# Altium project RTDMeasurement.PrjPcb (part 1 of 2)
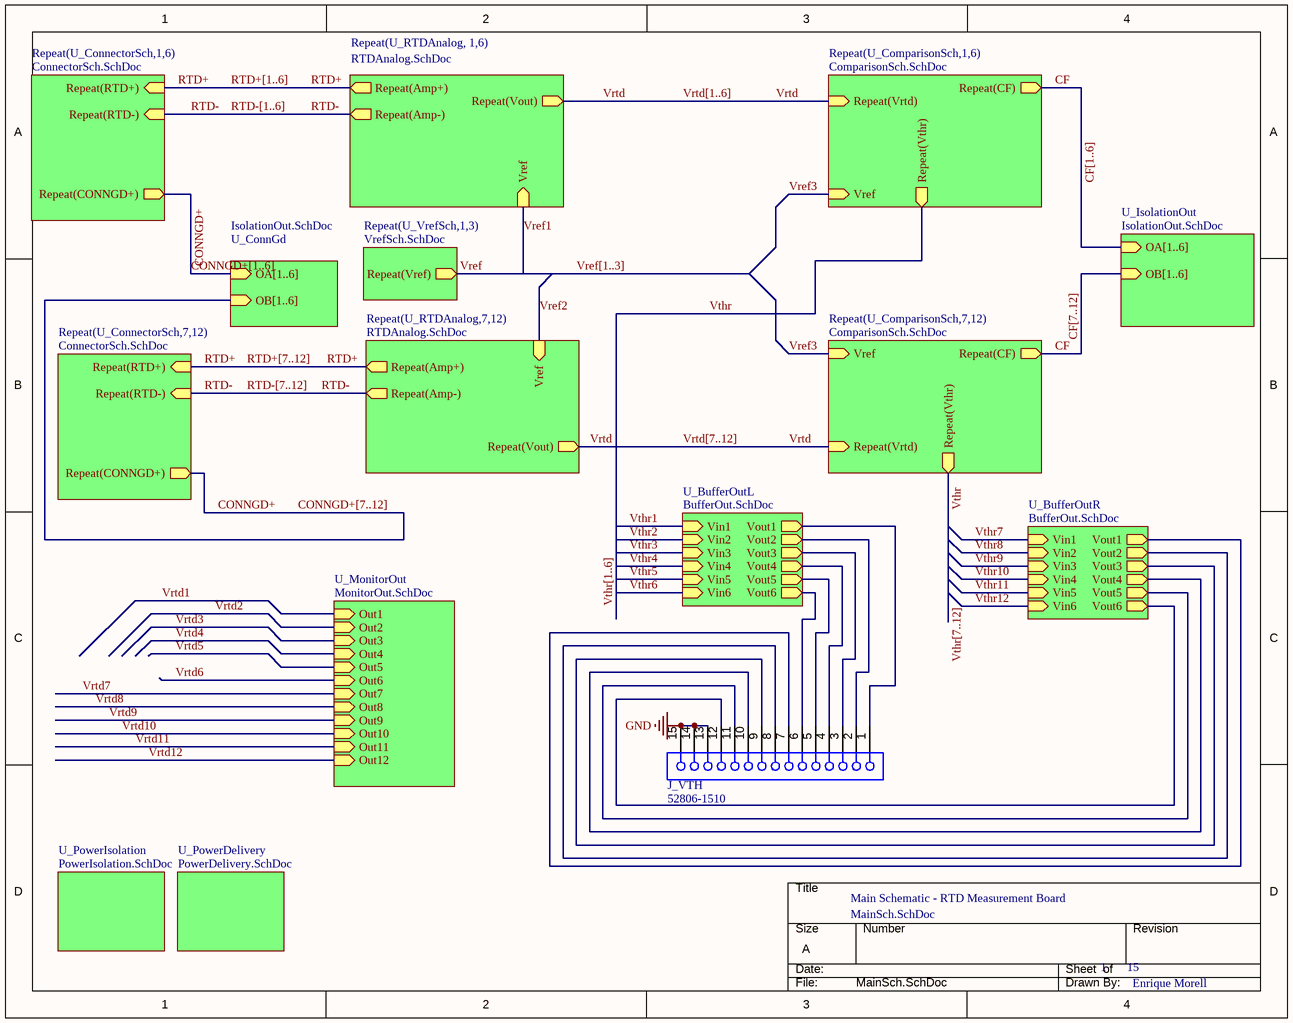
[diagram p0: MainSch.SchDoc]
14 sheets, 306 parts. Net scope: hierarchical (ports join the sheet entries above them; power ports are global).
Board files: RTD_12POS_WPS.PcbDoc, OneChannelPrototype.PcbDoc, RTD_12POS_WPSv2.PcbDoc, RTD_12POS_WPSv3.PcbDoc, RTD_12POS_WPSv4.PcbDoc
Sheets:
  MainSch.SchDoc
    U_RTDAnalog1 = RTDAnalog.SchDoc
    U_RTDAnalog2 = RTDAnalog.SchDoc
    U_RTDAnalog3 = RTDAnalog.SchDoc
    U_RTDAnalog4 = RTDAnalog.SchDoc
    U_RTDAnalog5 = RTDAnalog.SchDoc
    U_RTDAnalog6 = RTDAnalog.SchDoc
    U_VrefSch1 = VrefSch.SchDoc
    U_VrefSch2 = VrefSch.SchDoc
    U_VrefSch3 = VrefSch.SchDoc
    U_RTDAnalog7 = RTDAnalog.SchDoc
    U_RTDAnalog8 = RTDAnalog.SchDoc
    U_RTDAnalog9 = RTDAnalog.SchDoc
    U_RTDAnalog10 = RTDAnalog.SchDoc
    U_RTDAnalog11 = RTDAnalog.SchDoc
    U_RTDAnalog12 = RTDAnalog.SchDoc
    U_ConnectorSch1 = ConnectorSch.SchDoc
    U_ConnectorSch2 = ConnectorSch.SchDoc
    U_ConnectorSch3 = ConnectorSch.SchDoc
    U_ConnectorSch4 = ConnectorSch.SchDoc
    U_ConnectorSch5 = ConnectorSch.SchDoc
    U_ConnectorSch6 = ConnectorSch.SchDoc
    U_ComparisonSch1 = ComparisonSch.SchDoc
    U_ComparisonSch2 = ComparisonSch.SchDoc
    U_ComparisonSch3 = ComparisonSch.SchDoc
    U_ComparisonSch4 = ComparisonSch.SchDoc
    U_ComparisonSch5 = ComparisonSch.SchDoc
    U_ComparisonSch6 = ComparisonSch.SchDoc
    U_ComparisonSch7 = ComparisonSch.SchDoc
    U_ComparisonSch8 = ComparisonSch.SchDoc
    U_ComparisonSch9 = ComparisonSch.SchDoc
    U_ComparisonSch10 = ComparisonSch.SchDoc
    U_ComparisonSch11 = ComparisonSch.SchDoc
    U_ComparisonSch12 = ComparisonSch.SchDoc
    U_IsolationOut = IsolationOut.SchDoc
    U_PowerDelivery = PowerDelivery.SchDoc
      U_VccConnSch = VccConnSch.SchDoc
      U_Neg12V = Neg12V.SchDoc
      U_12VSupply = 12VSupply.SchDoc
      U_5VSupply = 5VSupply.SchDoc
    U_PowerIsolation = PowerIsolation.SchDoc
    U_MonitorOut = MonitorOut.SchDoc
      U_BufferOutMonL = BufferOut.SchDoc
      U_BufferOutMonR = BufferOut.SchDoc
    U_ConnectorSch7 = ConnectorSch.SchDoc
    U_ConnectorSch8 = ConnectorSch.SchDoc
    U_ConnectorSch9 = ConnectorSch.SchDoc
    U_ConnectorSch10 = ConnectorSch.SchDoc
    U_ConnectorSch11 = ConnectorSch.SchDoc
    U_ConnectorSch12 = ConnectorSch.SchDoc
    U_ConnGd = IsolationOut.SchDoc
    U_BufferOutR = BufferOut.SchDoc
    U_BufferOutL = BufferOut.SchDoc

## Sheet MainSch.SchDoc: Main Schematic - RTD Measurement Board
size A; Author: Enrique Morell; SheetNumber: 1; SheetTotal: 15

### Parts
J_VTH  52806-1510  [MOLX-52806-1510]

### Sub-sheets
Repeat(U_ComparisonSch,1,6) = ComparisonSch.SchDoc: Vref (in), Repeat(Vrtd) (in), Repeat(CF) (out), Repeat(Vthr) (out)
Repeat(U_ComparisonSch,7,12) = ComparisonSch.SchDoc: Vref (in), Repeat(Vrtd) (in), Repeat(CF) (out), Repeat(Vthr) (out)
Repeat(U_ConnectorSch,1,6) = ConnectorSch.SchDoc: Repeat(RTD+) (in), Repeat(RTD-) (in), Repeat(CONNGD+) (out)
Repeat(U_ConnectorSch,7,12) = ConnectorSch.SchDoc: Repeat(RTD+) (in), Repeat(RTD-) (in), Repeat(CONNGD+) (out)
Repeat(U_RTDAnalog,7,12) = RTDAnalog.SchDoc: Repeat(Amp+) (out), Vref (in), Repeat(Vout) (out), Repeat(Amp-) (out)
Repeat(U_RTDAnalog, 1,6) = RTDAnalog.SchDoc: Vref (in), Repeat(Amp+) (out), Repeat(Vout) (out), Repeat(Amp-) (out)
Repeat(U_VrefSch,1,3) = VrefSch.SchDoc: Repeat(Vref) (out)
U_BufferOutL = BufferOut.SchDoc: Vin1 (in), Vout1 (out), Vin2 (in), Vout2 (out), Vin3 (in), Vout3 (out), Vin4 (in), Vout4 (out), Vin5 (in), Vout5 (out), Vin6 (in), Vout6 (out)
U_BufferOutR = BufferOut.SchDoc: Vin1 (in), Vout1 (out), Vin2 (in), Vout2 (out), Vin3 (in), Vout3 (out), Vin4 (in), Vout4 (out), Vin5 (in), Vout5 (out), Vin6 (in), Vout6 (out)
U_ConnGd = IsolationOut.SchDoc: OA[1..6] (in), OB[1..6] (in)
U_IsolationOut = IsolationOut.SchDoc: OA[1..6] (in), OB[1..6] (in)
U_MonitorOut = MonitorOut.SchDoc: Out1 (in), Out2 (in), Out3 (in), Out4 (in), Out5 (in), Out6 (in), Out7 (in), Out9 (in), Out10 (in), Out11 (in), Out12 (in), Out8 (in)
U_PowerDelivery = PowerDelivery.SchDoc: no entries
U_PowerIsolation = PowerIsolation.SchDoc: no entries

### Nets
GND: J_VTH.13 J_VTH.14 J_VTH.15
CF: sheet Repeat(U_ComparisonSch,1,6)/Repeat(CF), sheet Repeat(U_ComparisonSch,7,12)/Repeat(CF)
CONNGD+: sheet Repeat(U_ConnectorSch,1,6)/Repeat(CONNGD+), sheet Repeat(U_ConnectorSch,7,12)/Repeat(CONNGD+)
RTD+: sheet Repeat(U_RTDAnalog, 1,6)/Repeat(Amp+), sheet Repeat(U_RTDAnalog,7,12)/Repeat(Amp+), sheet Repeat(U_ConnectorSch,1,6)/Repeat(RTD+), sheet Repeat(U_ConnectorSch,7,12)/Repeat(RTD+)
RTD-: sheet Repeat(U_RTDAnalog, 1,6)/Repeat(Amp-), sheet Repeat(U_RTDAnalog,7,12)/Repeat(Amp-), sheet Repeat(U_ConnectorSch,1,6)/Repeat(RTD-), sheet Repeat(U_ConnectorSch,7,12)/Repeat(RTD-)
Vref: sheet Repeat(U_VrefSch,1,3)/Repeat(Vref)
Vref3: sheet Repeat(U_ComparisonSch,1,6)/Vref, sheet Repeat(U_ComparisonSch,7,12)/Vref
Vrtd: sheet Repeat(U_RTDAnalog, 1,6)/Repeat(Vout), sheet Repeat(U_RTDAnalog,7,12)/Repeat(Vout), sheet Repeat(U_ComparisonSch,1,6)/Repeat(Vrtd), sheet Repeat(U_ComparisonSch,7,12)/Repeat(Vrtd)
Vthr: sheet Repeat(U_ComparisonSch,1,6)/Repeat(Vthr), sheet Repeat(U_ComparisonSch,7,12)/Repeat(Vthr)
NetJ_VTH_1: J_VTH.1 ; sheet U_BufferOutL/Vout1
NetJ_VTH_2: J_VTH.2 ; sheet U_BufferOutL/Vout2
NetJ_VTH_3: J_VTH.3 ; sheet U_BufferOutL/Vout3
NetJ_VTH_4: J_VTH.4 ; sheet U_BufferOutL/Vout4
NetJ_VTH_5: J_VTH.5 ; sheet U_BufferOutL/Vout5
NetJ_VTH_6: J_VTH.6 ; sheet U_BufferOutL/Vout6
NetJ_VTH_7: J_VTH.7 ; sheet U_BufferOutR/Vout1
NetJ_VTH_8: J_VTH.8 ; sheet U_BufferOutR/Vout2
NetJ_VTH_9: J_VTH.9 ; sheet U_BufferOutR/Vout3
NetJ_VTH_10: J_VTH.10 ; sheet U_BufferOutR/Vout4
NetJ_VTH_11: J_VTH.11 ; sheet U_BufferOutR/Vout5
NetJ_VTH_12: J_VTH.12 ; sheet U_BufferOutR/Vout6

### Buses and harness runs
bus CF[1..6] = sheet U_IsolationOut/OA[1..6]
bus CF[7..12] = sheet U_IsolationOut/OB[1..6]
bus CONNGD+[1..6] = sheet U_ConnGd/OA[1..6]
bus CONNGD+[7..12] = sheet U_ConnGd/OB[1..6]
bus RTD+[1..6]
bus RTD+[7..12]
bus RTD-[1..6]
bus RTD-[7..12]
bus Vref[1..3]
bus Vrtd[1..6]
bus Vrtd[7..12]
bus Vthr[1..6]
bus Vthr[7..12]

### Notes on the sheet
- THIS DOCUMENT AND THE DATA DISCLOSED HEREIN OR
- HEREWITH IS THE PROPERTY OF ALTIUM LIMITED AND MAY
- DWG NO:
- REVISION
- REV:
- DESCRIPTION
- DATE
- APPROVED
- BE FREELY DISTRIBUTED IN WHOLE. NO RIGHTS ARE
- RESERVED OR EXPRESS OR IMPLIED WARANTEE GIVEN.
- ENG:
- APPROVALS
- PROJECT
- DSN:
- CHK:
- REFERENCE DOCUMENTS
- PROJECT REVISION:
- TITLE
- DOCUMENT REVISION:
- DESIGN ITEM:
- BOM:
- FAB DWG:
- PCB DWG:
- ASSY DWG:
- SCALE:
- A3
- SIZE
- CAGE CODE
- FILE NAME
- DWG NO.
- SHEET
- OF
- REV

### Library data of the parts
J_VTH = CMP-1242-00172-1: 1.0 mm Pitch FFC Connector, 5.4 mm Mated Height, Vertical, Non-ZIF, Through Hole, 15 Circuits, -20 to 80 degC, ELV and RoHS Compliant, Tray; Manufacturer: Molex; Voltage (Max): 50V AC (RMS)/DC; Pitch - Mating Interface: 1.00mm; Circuits (maximum): 15; Durability (mating cycles max): 10; Stackable: No; Current (Max per Contact): 0.5A; Mated Height: 5.40mm; Material - Plating Mating: Tin; PCB Retention: None; Material - Metal: Phosphor Bronze; ComponentLink3URL: http://www.molex.com/pdm_docs/sd/528061510_sd.pdf; PartNumber: 52806-1510; ComponentLink2URL: http://www.molex.com/webdocs/datasheets/pdf/en-us/0528061510_FFC_FPC_CONNECTORS.pdf; PackageVersion: Rev. B, 08/2002; Pitch - Termination Interface: 1.00mm; Circuits (Loaded): 15; PackageDescription: 15-Lead FFC Connector, Pitch 1.0 mm; ComponentLink1URL: http://www.molex.com/molex/index.jsp; Packing: Tray; ComponentLink1Description: Manufacturer URL; Entry Angle: Vertical; Contact Position: N/A; PCB Locator: No; Number of Rows: 1; ComponentLink2Description: Datasheet; Material - Plating Termination: Tin; Orientation: Vertical; RoHS: TRUE; PackageReference: 52806-1510; ComponentLink3Description: Package Specification; Mounting Technology: Through Hole; Polarized to PCB: No

## Sheet RTDAnalog.SchDoc
size A
Used 12 times, as channels U_RTDAnalog1, U_RTDAnalog2, U_RTDAnalog3, U_RTDAnalog4, U_RTDAnalog5, U_RTDAnalog6, U_RTDAnalog7, U_RTDAnalog8, U_RTDAnalog9, U_RTDAnalog10, U_RTDAnalog11, U_RTDAnalog12. Parts and nets are listed once, with the designators drawn on the sheet.
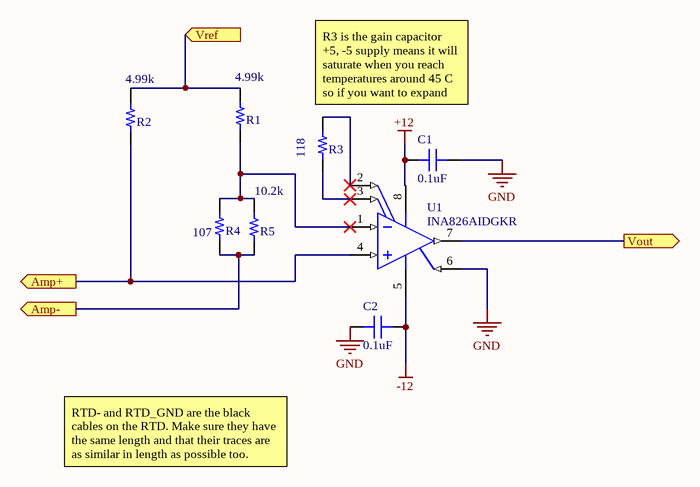
[diagram p1: RTDAnalog.SchDoc]

### Parts
C1  0.1uF  [CAP 0805/2012]
C2  0.1uF  [CAP 0805/2012]
R1  4.99k  [RES 0805/2012]
R2  4.99k  [RES 0805/2012]
R3  118  [RES 0805/2012]
R4  107  [RES 0805/2012]
R5  10.2k  [RES 0805/2012]
U1  INA826AIDGKR  [DGK0008A_N]

### Ports
Amp+ (out), Amp- (out), Vout (out), Vref (in)

### Nets
+12: C1.1 U1.8(VS+)
-12: C2.2 U1.5(VS-)
GND: C1.2 C2.1 U1.6(REF)
Amp+: R2.1 U1.4(IN+) ; port Amp+
Amp-: R4.1 R5.1 ; port Amp-
Vout: U1.7(VOUT) ; port Vout
Vref: R1.2 R2.2 ; port Vref
NetR1_1: R1.1 R4.2 R5.2 U1.1(IN-)
NetR3_1: R3.1 U1.3(RG)
NetR3_2: R3.2 U1.2(RG)

### Channels
U_RTDAnalog1: designators end in A; ports Amp+=RTD+1 Amp-=RTD-1 Vout=Vrtd1 Vref=Vref1
U_RTDAnalog2: designators end in B; ports Amp+=RTD+2 Amp-=RTD-2 Vout=Vrtd2 Vref=Vref1
U_RTDAnalog3: designators end in C; ports Amp+=RTD+3 Amp-=RTD-3 Vout=Vrtd3 Vref=Vref1
U_RTDAnalog4: designators end in D; ports Amp+=RTD+4 Amp-=RTD-4 Vout=Vrtd4 Vref=Vref1
U_RTDAnalog5: designators end in E; ports Amp+=RTD+5 Amp-=RTD-5 Vout=Vrtd5 Vref=Vref1
U_RTDAnalog6: designators end in F; ports Amp+=RTD+6 Amp-=RTD-6 Vout=Vrtd6 Vref=Vref1
U_RTDAnalog7: designators end in G; ports Amp+=RTD+7 Amp-=RTD-7 Vout=Vrtd7 Vref=Vref2
U_RTDAnalog8: designators end in H; ports Amp+=RTD+8 Amp-=RTD-8 Vout=Vrtd8 Vref=Vref2
U_RTDAnalog9: designators end in I; ports Amp+=RTD+9 Amp-=RTD-9 Vout=Vrtd9 Vref=Vref2
U_RTDAnalog10: designators end in J; ports Amp+=RTD+10 Amp-=RTD-10 Vout=Vrtd10 Vref=Vref2
U_RTDAnalog11: designators end in K; ports Amp+=RTD+11 Amp-=RTD-11 Vout=Vrtd11 Vref=Vref2
U_RTDAnalog12: designators end in L; ports Amp+=RTD+12 Amp-=RTD-12 Vout=Vrtd12 Vref=Vref2

### Notes on the sheet
- (near R3) R3 is the gain capacitor
  +5, -5 supply means it will saturate when you reach temperatures around 45 C so if you want to expand the range change the supply to +12, -12V. We use +5, -5 to simplify the power supply requirements considerably.
- RTD- and RTD_GND are the black cables on the RTD. Make sure they have the same length and that their traces are as similar in length as possible too.

### Library data of the parts
C1 C2 = CL21B104KACNNNC: CAP CER 0.1UF 25V X7R 0805; Manufacturer: Samsung Electro-Mechanics America, Inc.; TemperatureRange: -55C ~ 125C; Tolerance: 10%; Value: 0.1uF; Part Number: CL21B104KACNNNC; PartId: 5699; Supplier 1: Digi-Key; Supplier Part Number 1: 1276-1099-2-ND; ComponentLink1Description: Datasheet; ComponentLink1URL: http://www.samsungsem.com/kr/support/product-search/mlcc/CL21B104KACNNNC.jsp; ComponentLink2Description: Digi-Key listing; ComponentLink2URL: http://digikey.com/product-detail/en/CL21B104KACNNNC/1276-1099-2-ND/3886757; TemperatureCoefficient: X7R; Voltage: 25V; Price: 0.0099; Device Package: 0805 (2012 Metric); Type: -
R1 R2 = ERA-6AEB4991V: RES SMD 4.99K OHM 0.1% 1/8W 0805; Manufacturer: Panasonic Electronic Components; TemperatureRange: -55C ~ 155C; TemperatureCoefficient: 25ppm/C; PowerRating: 0.125W, 1/8W; Value: 4.99k; Part Number: ERA-6AEB4991V; PartId: 2457; Supplier 1: Digi-Key; Supplier Part Number 1: P4.99KDATR-ND; ComponentLink1Description: Datasheet; ComponentLink1URL: http://industrial.panasonic.com/lecs/www-data/pdf/AOA0000/AOA0000CE26.pdf; ComponentLink2Description: Digi-Key listing; ComponentLink2URL: http://digikey.com/product-detail/en/ERA-6AEB4991V/P4.99KDATR-ND/2025726; Tolerance: 0.1%; Price: 0.0653; Type: Thin Film; Device Package: 0805 (2012 Metric)
R3 = ERA-6AEB1180V: RES SMD 118 OHM 0.1% 1/8W 0805; Manufacturer: Panasonic Electronic Components; TemperatureRange: -55C ~ 155C; TemperatureCoefficient: 25ppm/C; PowerRating: 0.125W, 1/8W; Value: 118; Part Number: ERA-6AEB1180V; PartId: 2788; Supplier 1: Digi-Key; Supplier Part Number 1: P118DATR-ND; ComponentLink1Description: Datasheet; ComponentLink1URL: http://industrial.panasonic.com/lecs/www-data/pdf/AOA0000/AOA0000CE26.pdf; ComponentLink2Description: Digi-Key listing; ComponentLink2URL: http://digikey.com/product-detail/en/ERA-6AEB1180V/P118DATR-ND/2025579; Tolerance: 0.1%; Price: 0.0653; Type: Thin Film; Device Package: 0805 (2012 Metric)
R4 = ERA-6AEB1070V: RES SMD 107 OHM 0.1% 1/8W 0805; Manufacturer: Panasonic Electronic Components; TemperatureRange: -55C ~ 155C; TemperatureCoefficient: 25ppm/C; PowerRating: 0.125W, 1/8W; Value: 107; Part Number: ERA-6AEB1070V; PartId: 2810; Supplier 1: Digi-Key; Supplier Part Number 1: P107DATR-ND; ComponentLink1Description: Datasheet; ComponentLink1URL: http://industrial.panasonic.com/lecs/www-data/pdf/AOA0000/AOA0000CE26.pdf; ComponentLink2Description: Digi-Key listing; ComponentLink2URL: http://digikey.com/product-detail/en/ERA-6AEB1070V/P107DATR-ND/2025576; Tolerance: 0.1%; Price: 0.0653; Type: Thin Film; Device Package: 0805 (2012 Metric)
R5 = ERA-6AEB1022V: RES SMD 10.2K OHM 0.1% 1/8W 0805; Manufacturer: Panasonic Electronic Components; TemperatureRange: -55C ~ 155C; TemperatureCoefficient: 25ppm/C; PowerRating: 0.125W, 1/8W; Value: 10.2k; Part Number: ERA-6AEB1022V; PartId: 2668; Supplier 1: Digi-Key; Supplier Part Number 1: P10.2KDATR-ND; ComponentLink1Description: Datasheet; ComponentLink1URL: http://industrial.panasonic.com/lecs/www-data/pdf/AOA0000/AOA0000CE26.pdf; ComponentLink2Description: Digi-Key listing; ComponentLink2URL: http://digikey.com/product-detail/en/ERA-6AEB1022V/P10.2KDATR-ND/2025754; Tolerance: 0.1%; Price: 0.0653; Type: Thin Film; Device Package: 0805 (2012 Metric)
U1 = CMP-0944-00060-2: Precision, 200-uA Supply Current, 36-V Supply Instrumentation Amplifier, -40 to 125 degC, 8-pin SOP (DGK8), Green (RoHS & no Sb/Br); Manufacturer: Texas Instruments; Output Offset (+/-)(Max)(uV): 700; Input Offset Drift (+/-)(Max)(uV/Degrees Celsius): 2; Vs(Max)(V): 36; Non-Linearity (+/-)(Max)(%): 0.0005; Input Offset (+/-)(Max)(uV): 150; Output Offset Drift (+/-)(Max)(uV/Degrees Celsius): 10; Gain(V/V): 1 to 1000; CMRR(Min)(dB): 84; Noise at 1kHz(Typ)(nV/rt(Hz)): 18; Vs(Min)(V): 2.7; SubFamily: Single Supply; Number of Channels: 1; Input Bias Current (+/-)(Max)(nA): 65; Quiescent Current (+/-)(Typ)(mA): 0.2; ComponentLink1Description: Manufacturer URL; PartNumber: INA826AIDGKR; ComponentLink2URL: http://www.ti.com/general/docs/lit/getliterature.tsp?genericPartNumber=INA826&fileType=pdf; Code_JEDEC: MO-187; Eco-Plan: Green (RoHS & no Sb/Br); ComponentLink3URL: http://www.ti.com/litv/pdf/mpds028d; Mounting Technology: Surface Mount; ComponentLink3Description: Package Specification; PackageReference: DGK0008A; ComponentLink2Description: Datasheet; DatasheetVersion: SBOS562E; ComponentLink1URL: http://www.ti.com/; PackageDescription: 8-Pin Thin Small Outline, Body 3 x 3 mm, Pitch 0.65 mm; PackageVersion: 4073329/E, 05/2006

## Sheet VrefSch.SchDoc
size A
Used 3 times, as channels U_VrefSch1, U_VrefSch2, U_VrefSch3. Parts and nets are listed once, with the designators drawn on the sheet.
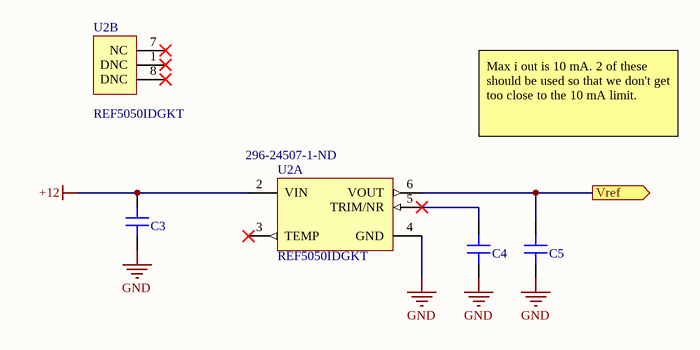
[diagram p2: VrefSch.SchDoc]

### Parts
C3  1uF  [CAP 0805/2012]  (value not drawn)
C4  1uF  [CAP 0805/2012]  (value not drawn)
C5  1uF  [CAP 0805/2012]  (value not drawn)
U2  REF5050IDGKT  Supplier Part Number 1: 296-24507-1-ND  [DGK0008A_N]  (parts A,B of 2)

### Ports
Vref (out)

### Nets
+12: C3.2 U2.2(VIN)
GND: C3.1 C4.1 C5.1 U2.4(GND)
Vref: C5.2 U2.6(VOUT) ; port Vref
NetC4_2: C4.2 U2.5(TRIM/NR)

Not connected (* = marked no-connect by the designer): U2 1(DNC)* 3(TEMP)* 7(NC)* 8(DNC)*

### Channels
U_VrefSch1: designators end in A; ports Vref=Vref1
U_VrefSch2: designators end in B; ports Vref=Vref2
U_VrefSch3: designators end in C; ports Vref=Vref3

### Notes on the sheet
- Max i out is 10 mA. 2 of these should be used so that we don't get too close to the 10 mA limit.

### Library data of the parts
C3-C5 = C0805C105J3RACTU: CAP CER 1UF 25V X7R 0805; Manufacturer: Kemet; TemperatureRange: -55C ~ 125C; Tolerance: 5%; Value: 1uF; Part Number: C0805C105J3RACTU; PartId: 6145; Supplier 1: Digi-Key; Supplier Part Number 1: 399-10060-2-ND; ComponentLink1Description: Datasheet; ComponentLink1URL: http://www.kemet.com/docfinder?Partnumber=C0805C105J3RACTU; ComponentLink2Description: Digi-Key listing; ComponentLink2URL: http://digikey.com/product-detail/en/C0805C105J3RACTU/399-10060-2-ND/2211758; TemperatureCoefficient: X7R; Voltage: 25V; Price: 0.355; Type: -; Device Package: 0805 (2012 Metric)
U2 = CMP-0367-00254-2: Low Noise, Very Low Drift, Precision Voltage Reference, -40 to 125 degC, 8-pin VSSOP (DGK), Green (RoHS & no Sb/Br); Manufacturer: Texas Instruments; VI(Min)(V): 5.2; Rating: Catalog; Initial Accuracy @ 25/deg C(%): 0.05; VO(V): 5; Iq(Max)(uA): 1000; SubFamily: Series Voltage Reference; Temp Coeff(Max)(ppm/ degree C): 3; Iout/Iz(Max)(mA): 10; VI(Max)(V): 18; ComponentLink1Description: Manufacturer URL; PartNumber: REF5050IDGKT; PackageVersion: 4073329/E; Code_JEDEC: MO-187; Eco-Plan: Green (RoHS & no Sb/Br); ComponentLink2Description: Datasheet; PackageReference: DGK0008A; ComponentLink2URL: http://www.ti.com/general/docs/lit/getliterature.tsp?genericPartNumber=REF5050&fileType=pdf; ComponentLink3URL: http://www.ti.com/litv/pdf/mpds028d; ComponentLink1URL: http://www.ti.com/; PackageDescription: 8-Pin Thin Small Outline Package 3 x 3 mm Body ,0.65 mm Pitch; ComponentLink3Description: Package Specification; Mounting Technology: Surface Mount; DatasheetVersion: SBOS410E; Supplier 1: Digi-Key

## Sheet ConnectorSch.SchDoc
size A
Used 12 times, as channels U_ConnectorSch1, U_ConnectorSch2, U_ConnectorSch3, U_ConnectorSch4, U_ConnectorSch5, U_ConnectorSch6, U_ConnectorSch7, U_ConnectorSch8, U_ConnectorSch9, U_ConnectorSch10, U_ConnectorSch11, U_ConnectorSch12. Parts and nets are listed once, with the designators drawn on the sheet.
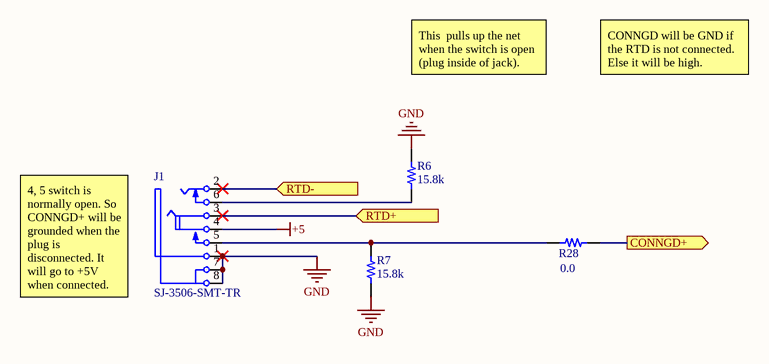
[diagram p3: ConnectorSch.SchDoc]

### Parts
J1  SJ-3506-SMT-TR  [CUI-SJ-3506-SMT-TR_V]
R6  15.8k  [RES 0805/2012]
R7  15.8k  [RES 0805/2012]
R28  0.0  [RES 1206/3216]

### Ports
CONNGD+ (out), RTD+ (in), RTD- (in)

### Nets
+5: J1.4(IR)
GND: J1.1(S) J1.7(SHLD1) J1.8(SHLD2) R6.1 R7.1
CONNGD+: R28.2 ; port CONNGD+
RTD+: J1.3(R) ; port RTD+
RTD-: J1.2(T) ; port RTD-
NetJ1_5: J1.5(RN) R7.2 R28.1
NetJ1_6: J1.6(TN) R6.2

### Channels
U_ConnectorSch1: designators end in A; ports CONNGD+=CONNGD+1 RTD+=RTD+1 RTD-=RTD-1
U_ConnectorSch2: designators end in B; ports CONNGD+=CONNGD+2 RTD+=RTD+2 RTD-=RTD-2
U_ConnectorSch3: designators end in C; ports CONNGD+=CONNGD+3 RTD+=RTD+3 RTD-=RTD-3
U_ConnectorSch4: designators end in D; ports CONNGD+=CONNGD+4 RTD+=RTD+4 RTD-=RTD-4
U_ConnectorSch5: designators end in E; ports CONNGD+=CONNGD+5 RTD+=RTD+5 RTD-=RTD-5
U_ConnectorSch6: designators end in F; ports CONNGD+=CONNGD+6 RTD+=RTD+6 RTD-=RTD-6
U_ConnectorSch7: designators end in G; ports CONNGD+=CONNGD+7 RTD+=RTD+7 RTD-=RTD-7
U_ConnectorSch8: designators end in H; ports CONNGD+=CONNGD+8 RTD+=RTD+8 RTD-=RTD-8
U_ConnectorSch9: designators end in I; ports CONNGD+=CONNGD+9 RTD+=RTD+9 RTD-=RTD-9
U_ConnectorSch10: designators end in J; ports CONNGD+=CONNGD+10 RTD+=RTD+10 RTD-=RTD-10
U_ConnectorSch11: designators end in K; ports CONNGD+=CONNGD+11 RTD+=RTD+11 RTD-=RTD-11
U_ConnectorSch12: designators end in L; ports CONNGD+=CONNGD+12 RTD+=RTD+12 RTD-=RTD-12

### Notes on the sheet
- This  pulls up the net when the switch is open (plug inside of jack).
- CONNGD will be GND if the RTD is not connected. Else it will be high.
- 4, 5 switch is normally open. So CONNGD+ will be grounded when the plug is disconnected. It will go to +5V when connected.

### Library data of the parts
J1 = CMP-1692-00003-1: Female Mid Mount Audio Jack, 6 Position, Height 2.55 mm, Tail Length 2 mm, -25 to 85 degC, RoHS, Tape and Reel; Current Rating: 7 A; Impedance: 50 Ohm; ComponentLink2URL: http://www.cui.com/product/resource/sj-3506-smt.pdf; DatasheetVersion: Rev. 1.01, 11/2012; Length: 5 mm; Radiation Hardening: No; ComponentLink1URL: http://www.cui.com/; ComponentLink2Description: Datasheet; PackageReference: SJ-3506-SMT-TR; Package Quantity: 500; Min Operating Temperature: -40degC; RoHSCompliant: True; Width: 3.6 mm; REACH SVHC: No SVHC; Mount: Through Hole; Diameter: 3.6 mm; ComponentLink1Description: Manufacturer URL; Max Operating Temperature: 85degC; Pins: 2; Case/Package: Axial; Height: 3.6 mm; PackageDescription: Female Mid Mount Audio Jack, 6 Position, Height 2.55 mm, Tail Length 2 mm; Packaging: Bulk
R6 R7 = ERJ-6ENF1582V: RES SMD 15.8K OHM 1% 1/8W 0805; Manufacturer: Panasonic Electronic Components; TemperatureRange: -55C ~ 155C; TemperatureCoefficient: 100ppm/C; PowerRating: 0.125W, 1/8W; Value: 15.8k; Part Number: ERJ-6ENF1582V; PartId: 2101; Supplier 1: Digi-Key; Supplier Part Number 1: P15.8KCTR-ND; ComponentLink1Description: Datasheet; ComponentLink1URL: http://industrial.panasonic.com/www-cgi/jvcr13pz.cgi?E+PZ+3+AOA0002+ERJ6ENF1582V+7+WW; ComponentLink2Description: Digi-Key listing; ComponentLink2URL: http://digikey.com/product-detail/en/ERJ-6ENF1582V/P15.8KCTR-ND/6419; Tolerance: 1%; Price: 0.0073; Type: Thick Film; Device Package: 0805 (2012 Metric)
R28 = ERJ-8GEY0R00V: RES SMD 0.0 OHM JUMPER 1/4W 1206; Manufacturer: Panasonic Electronic Components; TemperatureRange: -55C ~ 155C; PowerRating: 0.25W, 1/4W; Value: 0.0; Part Number: ERJ-8GEY0R00V; PartId: 16165; Supplier 1: Digi-Key; Supplier Part Number 1: P0.0ETR-ND; ComponentLink1Description: Datasheet; ComponentLink1URL: http://industrial.panasonic.com/www-cgi/jvcr13pz.cgi?E+PZ+3+AOA0001+ERJ8GEY0R00V+7+WW; ComponentLink2Description: Digi-Key Listing; ComponentLink2URL: https://www.digikey.com/product-detail/en/panasonic-electronic-components/ERJ-8GEY0R00V/P0.0ETR-ND/27495; Tolerance: Jumper; Price: 0.0067; Device Package: 1206 (3216 Metric)

## Sheet ComparisonSch.SchDoc
size A
Used 12 times, as channels U_ComparisonSch1, U_ComparisonSch2, U_ComparisonSch3, U_ComparisonSch4, U_ComparisonSch5, U_ComparisonSch6, U_ComparisonSch7, U_ComparisonSch8, U_ComparisonSch9, U_ComparisonSch10, U_ComparisonSch11, U_ComparisonSch12. Parts and nets are listed once, with the designators drawn on the sheet.
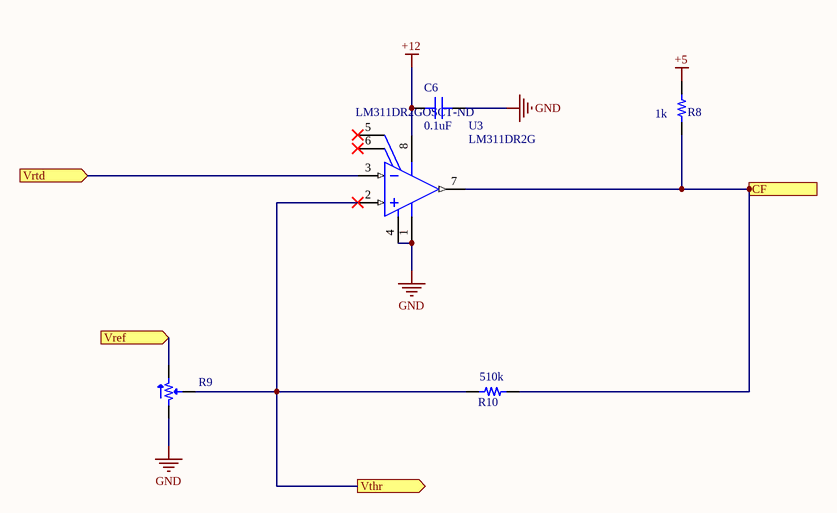
[diagram p4: ComparisonSch.SchDoc]

### Parts
C6  0.1uF  [CAP 0805/2012]
R8  1k  [RES 1206/3216]
R9  20k  [POT MODEL91A]  (value not drawn)
R10  510k  [RES 1206/3216]
U3  LM311DR2G  Supplier Part Number 1: LM311DR2GOSCT-ND  [ONSC-SOIC-8-751-07_V]

### Ports
CF (out), Vref (in), Vrtd (in), Vthr (out)

### Nets
+5: R8.2
+12: C6.1 U3.8(VCC)
GND: C6.2 R9.1 U3.1(GND) U3.4(VEE)
CF: R8.1 R10.2 U3.7(OUT) ; port CF
Vref: R9.3 ; port Vref
Vrtd: U3.3(IN-) ; port Vrtd
Vthr: R9.2 R10.1 U3.2(IN+) ; port Vthr

Not connected (* = marked no-connect by the designer): U3 5(BALANCE)* 6(BALANCE/STROBE)*

### Channels
U_ComparisonSch1: designators end in A; ports CF=CF1 Vref=Vref3 Vrtd=Vrtd1 Vthr=Vthr1
U_ComparisonSch2: designators end in B; ports CF=CF2 Vref=Vref3 Vrtd=Vrtd2 Vthr=Vthr2
U_ComparisonSch3: designators end in C; ports CF=CF3 Vref=Vref3 Vrtd=Vrtd3 Vthr=Vthr3
U_ComparisonSch4: designators end in D; ports CF=CF4 Vref=Vref3 Vrtd=Vrtd4 Vthr=Vthr4
U_ComparisonSch5: designators end in E; ports CF=CF5 Vref=Vref3 Vrtd=Vrtd5 Vthr=Vthr5
U_ComparisonSch6: designators end in F; ports CF=CF6 Vref=Vref3 Vrtd=Vrtd6 Vthr=Vthr6
U_ComparisonSch7: designators end in G; ports CF=CF7 Vref=Vref3 Vrtd=Vrtd7 Vthr=Vthr7
U_ComparisonSch8: designators end in H; ports CF=CF8 Vref=Vref3 Vrtd=Vrtd8 Vthr=Vthr8
U_ComparisonSch9: designators end in I; ports CF=CF9 Vref=Vref3 Vrtd=Vrtd9 Vthr=Vthr9
U_ComparisonSch10: designators end in J; ports CF=CF10 Vref=Vref3 Vrtd=Vrtd10 Vthr=Vthr10
U_ComparisonSch11: designators end in K; ports CF=CF11 Vref=Vref3 Vrtd=Vrtd11 Vthr=Vthr11
U_ComparisonSch12: designators end in L; ports CF=CF12 Vref=Vref3 Vrtd=Vrtd12 Vthr=Vthr12

### Library data of the parts
C6 = CL21B104KACNNNC: as C1 on sheet RTDAnalog; Value: 0.1uF; Part Number: CL21B104KACNNNC; PartId: 5699; Supplier 1: Digi-Key; Supplier Part Number 1: 1276-1099-2-ND; ComponentLink1Description: Datasheet; ComponentLink1URL: http://www.samsungsem.com/kr/support/product-search/mlcc/CL21B104KACNNNC.jsp; ComponentLink2Description: Digi-Key listing; ComponentLink2URL: http://digikey.com/product-detail/en/CL21B104KACNNNC/1276-1099-2-ND/3886757; TemperatureCoefficient: X7R; Voltage: 25V; Price: 0.0099; Device Package: 0805 (2012 Metric); Type: -
R8 = ERJ-8ENF1001V: RES SMD 1K OHM 1% 1/4W 1206; Manufacturer: Panasonic Electronic Components; TemperatureRange: -55C ~ 155C; TemperatureCoefficient: 100ppm/C; PowerRating: 0.25W, 1/4W; Value: 1k; Part Number: ERJ-8ENF1001V; PartId: 2958; Supplier 1: Digi-Key; Supplier Part Number 1: P1.00KFTR-ND; ComponentLink1Description: Datasheet; ComponentLink1URL: http://industrial.panasonic.com/www-cgi/jvcr13pz.cgi?E+PZ+3+AOA0002+ERJ8ENF1001V+7+WW; ComponentLink2Description: Digi-Key listing; ComponentLink2URL: http://digikey.com/product-detail/en/ERJ-8ENF1001V/P1.00KFTR-ND/86206; Tolerance: 1%; Price: 0.0093; Type: Thick Film; Device Package: 1206 (3216 Metric)
R9 = 91AR20KLF: TRIMMER 20K OHM 3/8" CERMET TH; Manufacturer: TT Electronics/BI; Tolerance: 20%; PowerRating: 0.5W, 1/2W; Number Of Turns: Single; Adjustment Type: Top Adjustment; Value: 20k; Part Number: 91AR20KLF; PartId: 7167; Supplier 1: Digi-Key; Supplier Part Number 1: 987-1170-ND; ComponentLink1Description: Datasheet; ComponentLink1URL: http://www.bitechnologies.com/pdfs/91.pdf; ComponentLink2Description: Digi-Key Listing; ComponentLink2URL: http://www.digikey.ca/product-detail/en/91AR20KLF/987-1170-ND/2408748; Price: 2.25; Type: Through Hole
R10 = ERJ-8GEYJ514V: RES SMD 510K OHM 5% 1/4W 1206; Manufacturer: Panasonic Electronic Components; TemperatureRange: -55C ~ 155C; TemperatureCoefficient: 200ppm/C; PowerRating: 0.25W, 1/4W; Value: 510k; Part Number: ERJ-8GEYJ514V; PartId: 11855; Supplier 1: Digi-Key; Supplier Part Number 1: P510KETR-ND; ComponentLink1Description: Datasheet; ComponentLink1URL: http://industrial.panasonic.com/www-cgi/jvcr13pz.cgi?E+PZ+3+AOA0001+ERJ8GEYJ514V+7+WW; ComponentLink2Description: Digi-Key Listing; ComponentLink2URL: https://www.digikey.com/product-detail/en/panasonic-electronic-components/ERJ-8GEYJ514V/P510KETR-ND/21336; Tolerance: 5%; Price: 0.0045; Device Package: 1206 (3216 Metric)
U3 = CMP-1305-00058-1: Single Comparator, 5 to 30 V, 0 to 70 degC, 8-Pin SOIC, Pb-Free, Tape and Reel; Manufacturer: On Semiconductor; VCC Max (V): 30; VCC Min (V): 5; ICC Typ (mA): 2.4; ComponentLink3Description: Package Specification; ComponentLink1URL: http://www.onsemi.com/; ComponentLink1Description: Manufacturer URL; Mounting Technology: Surface Mount; PackageDescription: 8-Pin Small Outline Integrated Circuit, Body 4.9 x 3.9 mm, Pitch 1.27 mm; ComponentLink2Description: Datasheet; RoHS: TRUE; ComponentLink2URL: http://www.onsemi.com/pub_link/Collateral/LM211-D.PDF; PackageVersion: Rev. AK, 02/2011; PackageReference: SOIC-8-751-07; DatasheetVersion: Rev. 6; Packing: Tape and Reel; ComponentLink3URL: http://www.onsemi.com/pub_link/Collateral/751-07.PDF; PartNumber: LM311DR2G; Supplier 1: Digi-Key

## Sheet IsolationOut.SchDoc
size A
Used 2 times, as channels U_IsolationOut, U_ConnGd. Parts and nets are listed once, with the designators drawn on the sheet.
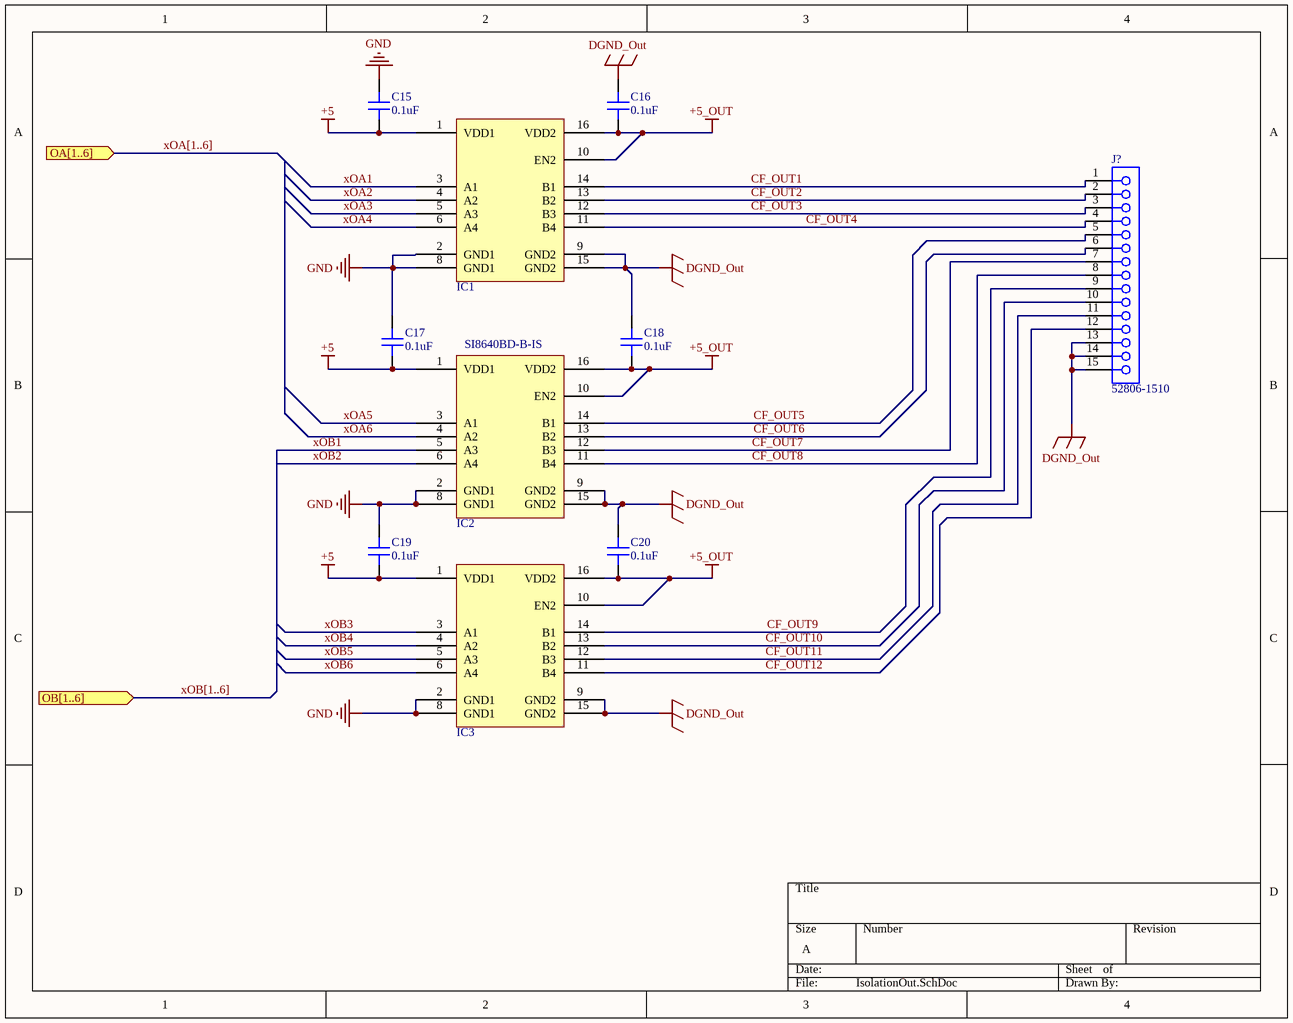
[diagram p5: IsolationOut.SchDoc]

### Parts
C15  0.1uF  [CAP 0805/2012]
C16  0.1uF  [CAP 0805/2012]
C17  0.1uF  [CAP 0805/2012]
C18  0.1uF  [CAP 0805/2012]
C19  0.1uF  [CAP 0805/2012]
C20  0.1uF  [CAP 0805/2012]
IC1  SI8640BD-B-IS  [SI LABS SOIC-16 WIDE]  (value not drawn)
IC2  SI8640BD-B-IS  [SI LABS SOIC-16 WIDE]
IC3  SI8640BD-B-IS  [SI LABS SOIC-16 WIDE]  (value not drawn)
J?  52806-1510  [MOLX-52806-1510]

### Ports
OA[1..6] (in), OB[1..6] (in)

### Nets
+5: C15.1 C17.1 C19.1 IC1.1(VDD1) IC2.1(VDD1) IC3.1(VDD1)
+5_OUT: C16.1 C18.1 C20.1 IC1.10(EN2) IC1.16(VDD2) IC2.10(EN2) IC2.16(VDD2) IC3.10(EN2) IC3.16(VDD2)
DGND_Out: C16.2 C18.2 C20.2 IC1.9(GND2) IC1.15(GND2) IC2.9(GND2) IC2.15(GND2) IC3.9(GND2) IC3.15(GND2) J?.13 J?.14 J?.15
GND: C15.2 C17.2 C19.2 IC1.2(GND1) IC1.8(GND1) IC2.2(GND1) IC2.8(GND1) IC3.2(GND1) IC3.8(GND1)
CF_OUT1: IC1.14(B1) J?.1
CF_OUT2: IC1.13(B2) J?.2
CF_OUT3: IC1.12(B3) J?.3
CF_OUT4: IC1.11(B4) J?.4
CF_OUT5: IC2.14(B1) J?.5
CF_OUT6: IC2.13(B2) J?.6
CF_OUT7: IC2.12(B3) J?.7
CF_OUT8: IC2.11(B4) J?.8
CF_OUT9: IC3.14(B1) J?.9
CF_OUT10: IC3.13(B2) J?.10
CF_OUT11: IC3.12(B3) J?.11
CF_OUT12: IC3.11(B4) J?.12
xOA1: IC1.3(A1)
xOA2: IC1.4(A2)
xOA3: IC1.5(A3)
xOA4: IC1.6(A4)
xOA5: IC2.3(A1)
xOA6: IC2.4(A2)
xOB1: IC2.5(A3)
xOB2: IC2.6(A4)
xOB3: IC3.3(A1)
xOB4: IC3.4(A2)
xOB5: IC3.5(A3)
xOB6: IC3.6(A4)

### Channels
U_IsolationOut: designators end in A
U_ConnGd: designators end in B

### Buses and harness runs
bus xOA[1..6] = port OA[1..6]
bus xOB[1..6] = port OB[1..6]

### Library data of the parts
C15-C20 = CL21B104KACNNNC: as C1 on sheet RTDAnalog; Value: 0.1uF; Part Number: CL21B104KACNNNC; PartId: 5699; Supplier 1: Digi-Key; Supplier Part Number 1: 1276-1099-2-ND; ComponentLink1Description: Datasheet; ComponentLink1URL: http://www.samsungsem.com/kr/support/product-search/mlcc/CL21B104KACNNNC.jsp; ComponentLink2Description: Digi-Key listing; ComponentLink2URL: http://digikey.com/product-detail/en/CL21B104KACNNNC/1276-1099-2-ND/3886757; TemperatureCoefficient: X7R; Voltage: 25V; Price: 0.0099; Device Package: 0805 (2012 Metric); Type: -
IC1-IC3 = SI8640BD-B-IS: DGTL ISO 5KV 4CH GEN PURP 16SOIC; Manufacturer: Silicon Labs; Isolated Power: No; Number of Channels: 4; Inputs - Side 1/Side2: 4/0; Channel Type: Unidirectional; Voltage - Isolation: 5000Vrms; Common Mode Transient Immunity (Min): 35kV/us; Data Rate: 150Mbps; Propagation Delay tpLH/tpHL (Max): 13ns, 13ns; Pulse Width Distortion (Max): 4.5ns; Rise / Fall Time (Typ): 2.5ns, 2.5ns; Voltage - Supply: 2.5 V ~ 5.5 V; Part Number: SI8640BD-B-IS; PartId: 14404; Supplier 1: Digi-Key; Supplier Part Number 1: 336-2083-5-ND; ComponentLink1Description: Datasheet; ComponentLink1URL: http://www.silabs.com/Support%20Documents/TechnicalDocs/Si864x.pdf; ComponentLink2Description: Digi-Key Listing; ComponentLink2URL: https://www.digikey.com/product-detail/en/silicon-labs/SI8640BD-B-IS/336-2083-5-ND/2623331; Price: 5.01; Type: General Purpose; Device Package: 16-SOIC (0.295", 7.50mm Width); Operating Temperature: -40C ~ 125C; Technology: Capacitive Coupling
J? = CMP-1242-00172-1: as J_VTH on sheet MainSch; ComponentLink3URL: http://www.molex.com/pdm_docs/sd/528061510_sd.pdf; PartNumber: 52806-1510; ComponentLink2URL: http://www.molex.com/webdocs/datasheets/pdf/en-us/0528061510_FFC_FPC_CONNECTORS.pdf; PackageVersion: Rev. B, 08/2002; Pitch - Termination Interface: 1.00mm; Circuits (Loaded): 15; PackageDescription: 15-Lead FFC Connector, Pitch 1.0 mm; ComponentLink1URL: http://www.molex.com/molex/index.jsp; Packing: Tray; ComponentLink1Description: Manufacturer URL; Entry Angle: Vertical; Contact Position: N/A; PCB Locator: No; Number of Rows: 1; ComponentLink2Description: Datasheet; Material - Plating Termination: Tin; Orientation: Vertical; RoHS: TRUE; PackageReference: 52806-1510; ComponentLink3Description: Package Specification; Mounting Technology: Through Hole; Polarized to PCB: No

## Sheet PowerDelivery.SchDoc
size A
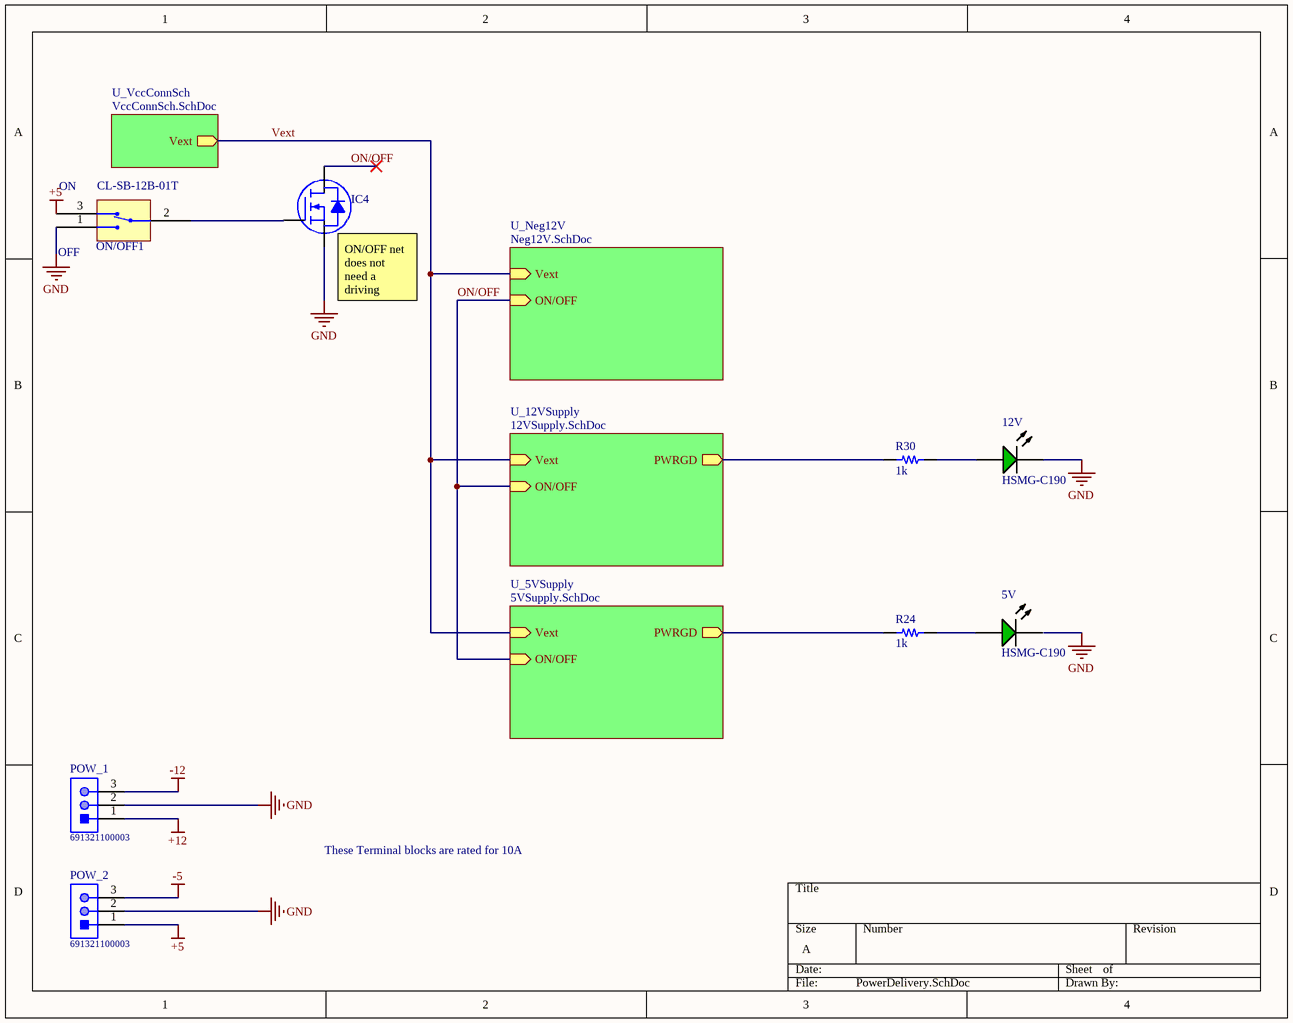
[diagram p6: PowerDelivery.SchDoc]

### Parts
5V  HSMG-C190  [AVAG-HSMX-C190_V]
12V  HSMG-C190  [AVAG-HSMX-C190_V]
IC4  BSS138WH6327XTSA1  [INFINEON SOT-323-3]  (value not drawn)
ON/OFF1  CL-SB-12B-01T  [SW_CL-SB-12B-01]
POW_1  691321100003  [691321100003]
POW_2  691321100003  [691321100003]
R24  1k  [RES 1206/3216]
R30  1k  [RES 1206/3216]

### Sub-sheets
U_5VSupply = 5VSupply.SchDoc: Vext (in), ON/OFF (in), PWRGD (out)
U_12VSupply = 12VSupply.SchDoc: Vext (in), ON/OFF (in), PWRGD (out)
U_Neg12V = Neg12V.SchDoc: Vext (in), ON/OFF (in)
U_VccConnSch = VccConnSch.SchDoc: Vext (out)

### Nets
+5: ON/OFF1.3(GND) POW_2.1
+12: POW_1.1
-5: POW_2.3
-12: POW_1.3
GND: 12V.2(K) IC4.3(S) ON/OFF1.1(GND) POW_1.2 POW_2.2
ON/OFF: IC4.2(D) ; sheet U_Neg12V/ON/OFF, sheet U_12VSupply/ON/OFF, sheet U_5VSupply/ON/OFF
Vext: sheet U_VccConnSch/Vext, sheet U_Neg12V/Vext, sheet U_12VSupply/Vext, sheet U_5VSupply/Vext
Net5V_1: 5V.1(A) R24.1
Net12V_1: 12V.1(A) R30.1
NetIC4_1: IC4.1(G) ON/OFF1.2(GND)
NetR15_2: R30.2 ; sheet U_12VSupply/PWRGD
NetR19_2: R24.2 ; sheet U_5VSupply/PWRGD

Not connected (* = marked no-connect by the designer): 5V 2(K)

### Notes on the sheet
- (near ON/OFF1) ON
- (near ON/OFF1) OFF
- (near IC4) ON/OFF net does not need a driving source since the component has an internal pull up. Check note in Neg5V sch.
- These Terminal blocks are rated for 10A

### Library data of the parts
5V 12V = CMP-1744-00002-1: Chip LED, Green, 2.2 V, -40 to 85 degC, 2-Pin SMD, RoHS, Tape and Reel; Frequency: 400 KHz; Max Supply Voltage: 5.5 V; Access Time: 3500 ns; Clock Frequency: 100 KHz; Case\Package: SOIC; Density: 32 kb; Nominal Supply Current: 2 mA; Interface: Serial; Min Supply Voltage: 1.7 V; Packaging: Tape and Reel; PackageReference: HSMX-C190; ComponentLink2URL: http://docs.avagotech.com/docs/AV02-0551EN; RoHSCompliant: true; Pins: 8; REACH SVHC: No SVHC; Max Operating Temperature: 85 degC; Width: 4 mm; Radiation Hardening: No; Package Quantity: 3000; ComponentLink3Description: Package Specification; ComponentLink1Description: Manufacturer URL; Min Operating Temperature: -40 degC; PackageDescription: 2-Pin Surface Mount Device, Body 1.6 x 0.8 mm, Height 0.9 mm; Max Clock Frequency: 100 KHz; Height: 1.5 mm; ComponentLink1URL: http://www.avagotech.com/; DatasheetVersion: Mar-12; ComponentLink2Description: Datasheet; Mount: Surface Mount; Length: 5 mm; ComponentLink3URL: http://www.fairchildsemi.com/dwg/MA/MA03D.pdf
IC4 = BSS138WH6327XTSA1: MOSFET N-CH 60V 280MA SOT-323; Manufacturer: Infineon Technologies; Rds On (Max) at Id, Vgs: 3.5 Ohm @ 200mA, 10V; Vgs(th) (Max) at Id: 1.4V @ 26uA; Gate Charge (Qg): 1.5nC @ 10V; Input Capacitance (Ciss) at Vds: 43pF @ 25V; Power - Max: 500mW; Current Continuous Drain: 280mA (Ta); Part Number: BSS138WH6327XTSA1; PartId: 8084; Supplier 1: Digi-Key; Supplier Part Number 1: BSS138WH6327XTSA1TR-ND; ComponentLink1Description: Datasheet; ComponentLink1URL: http://www.infineon.com/dgdl/Infineon-BSS138W-DS-v02_43-en.pdf?fileId=db3a304335113a6301351e62fcb4131f; ComponentLink2Description: Digi-Key Listing; ComponentLink2URL: http://www.digikey.com/product-detail/en/BSS138WH6327XTSA1/BSS138WH6327XTSA1TR-ND/5410120; Price: 0.0483; Type: MOSFET N-Channel, Metal Oxide; Device Package: SC-70, SOT-323; Drain to Source Voltage (Vdss): 60V; Features: Logic Level Gate
ON/OFF1 = CL-SB-12B-01T: SWITCH SLIDE SPDT 200MA 12V; Manufacturer: Nidec Copal Electronics; Switch Function: On-On; Actuator Type: Standard; Switch Travel: 2.00mm; Mechanical Life: 10,000 Cycles; Part Number: CL-SB-12B-01T; PartId: 16472; Supplier 1: Digi-Key; Supplier Part Number 1: 563-1318-1-ND; ComponentLink1Description: Datasheet; ComponentLink1URL: https://www.nidec-copal-electronics.com/e/catalog/switch/cl-sb.pdf; ComponentLink2Description: Digi-Key Listing; ComponentLink2URL: https://www.digikey.com/product-detail/en/nidec-copal-electronics/CL-SB-12B-01T/563-1318-1-ND/3507878; Price: 0.9; TYPE: Slide Switches; Series: CL-SB; Circuit: SPDT; Operating Temperature: -40°C ~ 85°C
POW_1 POW_2 = CMP-1502-01784-1: Serie 3211 - 3.50mm Vertical PCB Header WR-TBL, 3 pin; Manufacturer: Wurth Elektronik; Pin Number: 3; Gender: Male; Datasheet URL: http://katalog.we-online.de/em/datasheet/6913211000xx.pdf; Package Reference: 691321100003; Pitch: 3.50mm; Publisher: WurthElektronik; Part Number: 691321100003; Mounting Technology: THT; Packaging: Box; Manufacturer URL: http://www.we-online.de; Operating Temperature: -40to105degC
R24 R30 = ERJ-8ENF1001V: as R8 on sheet ComparisonSch; Value: 1k; Part Number: ERJ-8ENF1001V; PartId: 2958; Supplier 1: Digi-Key; Supplier Part Number 1: P1.00KFTR-ND; ComponentLink1Description: Datasheet; ComponentLink1URL: http://industrial.panasonic.com/www-cgi/jvcr13pz.cgi?E+PZ+3+AOA0002+ERJ8ENF1001V+7+WW; ComponentLink2Description: Digi-Key listing; ComponentLink2URL: http://digikey.com/product-detail/en/ERJ-8ENF1001V/P1.00KFTR-ND/86206; Tolerance: 1%; Price: 0.0093; Type: Thick Film; Device Package: 1206 (3216 Metric)

## Sheet VccConnSch.SchDoc
size A
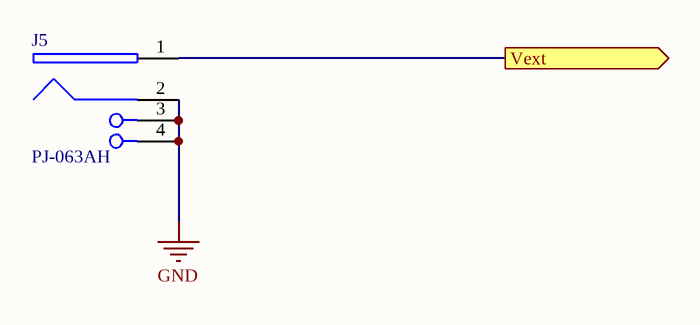
[diagram p7: VccConnSch.SchDoc]

### Parts
J5  PJ-063AH  [CUI-PJ-063AH_V]

### Ports
Vext (out)

### Nets
GND: J5.2 J5.3(SHLD) J5.4(SHLD)
Vext: J5.1 ; port Vext

### Library data of the parts
J5 = CMP-2000-06898-1: Through Hole Right Angle DC Power Jack, 8 A, 2 mm Center Pin, 2 Position, -25 to 85 degC, RoHS, Bulk; Manufacturer: CUIInc.; Voltage Rating: 24V; Current Rating: 8A; Inside Contact Diameter: 2mm; Insulation Resistance: 100MOhms; Outside Contact Diameter: 6.5mm; Brand: CUI; Termination Style: ThroughHole; Flammability Rating: UL94V-0; Datasheet Version: Rev. 1.02, 03/2016; Manufacturer URL: http://www.cui.com/; Product Category: DCPowerConnectors; Package Description: 2-Pin Through Hole Device, Body 13 x 10 mm, Height 9 mm; Connector Type: DCPowerJack; Factory Pack Quantity: 500; Contact Plating: Nickel; Mounting Style: KinkedPin; Contact Material: Copper; RoHS: True; Mounting Angle: Right; Package Reference: PJ-063AH; Product: Jacks; Contact Gender: Male; Datasheet URL: http://www.cui.com/product/resource/pj-063ah.pdf; Housing Material: PolybutyleneTerephthalate(PBT); Mounting Technology: ThroughHole; Operating Temperature Range: -25Cto+85C

## Sheet Neg12V.SchDoc
size A
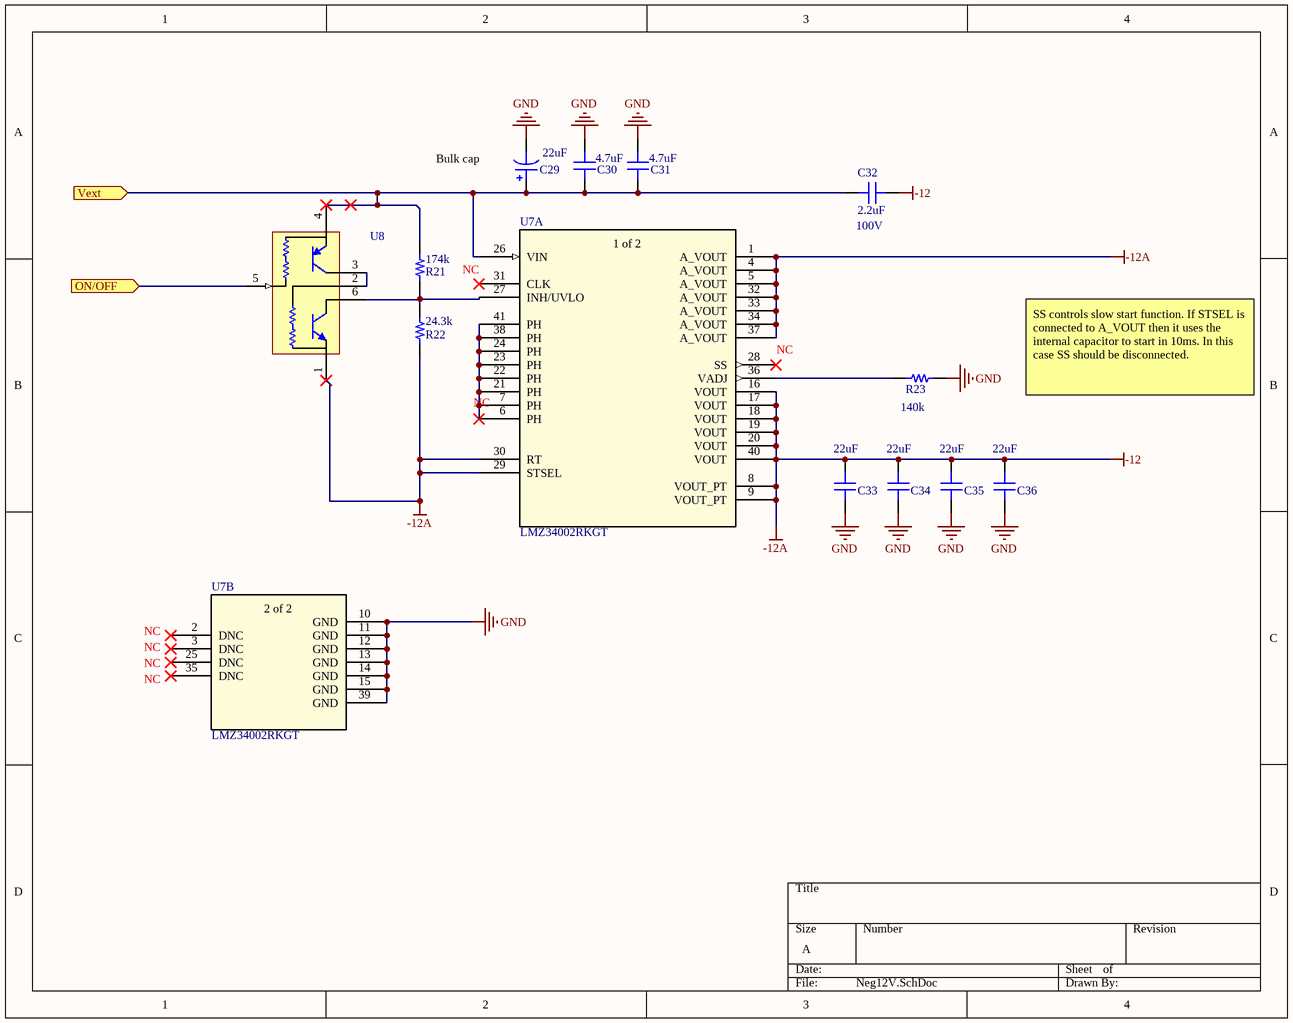
[diagram p8: Neg12V.SchDoc]

### Parts
C29  22uF  [CAP AL TH D8 L3.5 H11.5]
C30  4.7uF  [CAP 1206/3216 - 1.0MM]
C31  4.7uF  [CAP 1206/3216 - 1.0MM]
C32  2.2uF  [CAP 1206/3216]
C33  22uF  [CAP 1206/3216]
C34  22uF  [CAP 1206/3216]
C35  22uF  [CAP 1206/3216]
C36  22uF  [CAP 1206/3216]
R21  174k  [RES 0805/2012]
R22  24.3k  [RES 0805/2012]
R23  140k  [RES 0805/2012]
U7  LMZ34002RKGT  [RKG41]  (parts A,B of 2)
U8  DCX144EH-7  [SOT-563]  (value not drawn)

### Ports
ON/OFF (in), Vext (in)

### Nets
-12: C32.1 C33.2 C34.2 C35.2 C36.2 R22.1 U7.1(A_VOUT) U7.4(A_VOUT) U7.5(A_VOUT) U7.8(VOUT_PT) U7.9(VOUT_PT) U7.16(VOUT) U7.17(VOUT) U7.18(VOUT) U7.19(VOUT) U7.20(VOUT) U7.29(STSEL) U7.30(RT) U7.32(A_VOUT) U7.33(A_VOUT) U7.34(A_VOUT) U7.37(A_VOUT) U7.40(VOUT) U8.1  [also labelled -12A]
GND: C29.2 C30.2 C31.2 C33.1 C34.1 C35.1 C36.1 R23.2 U7.10(GND) U7.11(GND) U7.12(GND) U7.13(GND) U7.14(GND) U7.15(GND) U7.39(GND)
ON/OFF: U8.5 ; port ON/OFF
Vext: C29.1 C30.1 C31.1 C32.2 R21.2 U7.26(VIN) U8.4 ; port Vext
NetR21_1: R21.1 R22.2 U7.27(INH/UVLO) U8.6
NetR23_1: R23.1 U7.36(VADJ)
NetU7_6: U7.6(PH) U7.7(PH) U7.21(PH) U7.22(PH) U7.23(PH) U7.24(PH) U7.38(PH) U7.41(PH)
NetU8_2: U8.2 U8.3

Not connected (* = marked no-connect by the designer): U7 2(DNC)* 3(DNC)* 25(DNC)* 28(SS)* 31(CLK)* 35(DNC)*

### Notes on the sheet
- (near C29) Bulk cap
- (near C32) 100V
- NC
- (near U7) NC
- SS controls slow start function. If STSEL is connected to A_VOUT then it uses the internal capacitor to start in 10ms. In this case SS should be disconnected.
- (in symbol LMZ34002RKGT, part A) 1 of 2
- (in symbol LMZ34002RKGT, part B) 2 of 2

### Library data of the parts
C29 = EEU-FC2A220: CAP ALUM 22UF 20% 100V RADIAL; Manufacturer: Panasonic Electronic Components; TemperatureRange: -55°C ~ 105°C; Type: Automotive; Ripple Current: 169mA; Lifetime @ Temp: 2000 Hrs @ 105°C; Value: 22uF; Part Number: EEU-FC2A220; PartId: 7484; Supplier 1: Digi-Key; Supplier Part Number 1: P10770-ND; ComponentLink1Description: Datasheet; ComponentLink1URL: https://industrial.panasonic.com/ww/products/capacitors/aluminum-capacitors/aluminum-cap-lead/fc/EEUFC2A220; ComponentLink2Description: Digi-Key listing; ComponentLink2URL: https://www.digikey.com/product-detail/en/panasonic-electronic-components/EEU-FC2A220/P10770-ND/285722; Tolerance: 20%; Voltage: 100V; Price: 0.46; Device Package: Radial, Can - TH
C30 C31 = C3216X5R1H475K085AB: CAP CER 4.7UF 50V X5R 1206; Manufacturer: TDK Corporation; TemperatureRange: -55C ~ 85C; Tolerance: 10%; Value: 4.7uF; Part Number: C3216X5R1H475K085AB; PartId: 17022; Supplier 1: Digi-Key; Supplier Part Number 1: 445-14692-2-ND; ComponentLink1Description: Datasheet; ComponentLink1URL: https://product.tdk.com/info/en/catalog/datasheets/mlcc_commercial_general_en.pdf; ComponentLink2Description: Digi-Key Listing; ComponentLink2URL: https://www.digikey.com/product-detail/en/tdk-corporation/C3216X5R1H475K085AB/445-14692-2-ND/3951928; TemperatureCoefficient: X5R; Voltage: 50V; Price: 0.3159; Device Package: 1206 (3216 Metric)
C32 = CL31B225KCHSNNE: CAP CER 2.2UF 100V X7R 1206; Manufacturer: Samsung Electro-Mechanics America, Inc.; TemperatureRange: -55C ~ 125C; Tolerance: 10%; Value: 2.2uF; Part Number: CL31B225KCHSNNE; PartId: 6260; Supplier 1: Digi-Key; Supplier Part Number 1: 1276-3138-2-ND; ComponentLink1Description: Datasheet; ComponentLink1URL: http://media.digikey.com/pdf/Data%20Sheets/Samsung%20PDFs/CL31B225KCHSNNE_Spec.pdf; ComponentLink2Description: Digi-Key listing; ComponentLink2URL: http://digikey.com/product-detail/en/CL31B225KCHSNNE/1276-3138-2-ND/3888796; TemperatureCoefficient: X7R; Voltage: 100V; Price: 0.3227; Type: -; Device Package: 1206 (3216 Metric)
C33-C36 = CL31A226KAHNNNE: CAP CER 22UF 25V X5R 1206; Manufacturer: Samsung Electro-Mechanics America, Inc.; TemperatureRange: -55C ~ 85C; Tolerance: 10%; Value: 22uF; Part Number: CL31A226KAHNNNE; PartId: 15794; Supplier 1: Digi-Key; Supplier Part Number 1: 1276-3047-2-ND; ComponentLink1Description: Datasheet; ComponentLink1URL: //media.digikey.com/pdf/Data%20Sheets/Samsung%20PDFs/CL31A226KAHNNNE_Spec.pdf; ComponentLink2Description: Digi-Key Listing; ComponentLink2URL: https://www.digikey.com/product-detail/en/samsung-electro-mechanics-america-inc/CL31A226KAHNNNE/1276-3047-2-ND/3888705; TemperatureCoefficient: X5R; Voltage: 25V; Price: 0.1785; Device Package: 1206 (3216 Metric)
R21 = ERJ-6ENF1743V: RES SMD 174K OHM 1% 1/8W 0805; Manufacturer: Panasonic Electronic Components; TemperatureRange: -55C ~ 155C; TemperatureCoefficient: 100ppm/C; PowerRating: 0.125W, 1/8W; Value: 174k; Part Number: ERJ-6ENF1743V; PartId: 2344; Supplier 1: Digi-Key; Supplier Part Number 1: P174KCTR-ND; ComponentLink1Description: Datasheet; ComponentLink1URL: http://industrial.panasonic.com/www-cgi/jvcr13pz.cgi?E+PZ+3+AOA0002+ERJ6ENF1743V+7+WW; ComponentLink2Description: Digi-Key listing; ComponentLink2URL: http://digikey.com/product-detail/en/ERJ-6ENF1743V/P174KCTR-ND/111921; Tolerance: 1%; Price: 0.0073; Type: Thick Film; Device Package: 0805 (2012 Metric)
R22 = ERJ-6ENF2432V: RES SMD 24.3K OHM 1% 1/8W 0805; Manufacturer: Panasonic Electronic Components; TemperatureRange: -55C ~ 155C; TemperatureCoefficient: 100ppm/C; PowerRating: 0.125W, 1/8W; Value: 24.3k; Part Number: ERJ-6ENF2432V; PartId: 2331; Supplier 1: Digi-Key; Supplier Part Number 1: P24.3KCTR-ND; ComponentLink1Description: Datasheet; ComponentLink1URL: http://industrial.panasonic.com/www-cgi/jvcr13pz.cgi?E+PZ+3+AOA0002+ERJ6ENF2432V+7+WW; ComponentLink2Description: Digi-Key listing; ComponentLink2URL: http://digikey.com/product-detail/en/ERJ-6ENF2432V/P24.3KCTR-ND/111548; Tolerance: 1%; Price: 0.0073; Type: Thick Film; Device Package: 0805 (2012 Metric)
R23 = ERJ-6ENF1403V: RES SMD 140K OHM 1% 1/8W 0805; Manufacturer: Panasonic Electronic Components; TemperatureRange: -55C ~ 155C; TemperatureCoefficient: 100ppm/C; PowerRating: 0.125W, 1/8W; Value: 140k; Part Number: ERJ-6ENF1403V; PartId: 2209; Supplier 1: Digi-Key; Supplier Part Number 1: P140KCTR-ND; ComponentLink1Description: Datasheet; ComponentLink1URL: http://industrial.panasonic.com/www-cgi/jvcr13pz.cgi?E+PZ+3+AOA0002+ERJ6ENF1403V+7+WW; ComponentLink2Description: Digi-Key listing; ComponentLink2URL: http://digikey.com/product-detail/en/ERJ-6ENF1403V/P140KCTR-ND/111888; Tolerance: 1%; Price: 0.0073; Type: Thick Film; Device Package: 0805 (2012 Metric)
U7 = LMZ34002RKGT: No Description Available; Vendor: Texas Instruments; Built_By: EMA_UL_Team; Manufacturer_Part_Number: LMZ34002RKGT; Copyright: Copyright (C) 2018 Accelerated Designs. All rights reserved; RefDes: RefDes; Type: DEV; Value: Value
U8 = DCX144EH-7: TRANS PREBIAS NPN/PNP SOT563; Manufacturer: Diodes Incorporated; Power - Max: 150mW; Part Number: DCX144EH-7; PartId: 9696; Supplier 1: Digi-Key; Supplier Part Number 1: DCX144EH-7DICT-ND; ComponentLink1Description: Datasheet; ComponentLink1URL: https://www.diodes.com/assets/Datasheets/ds30422.pdf; ComponentLink2Description: Digi-Key Listing; ComponentLink2URL: https://www.digikey.com/product-detail/en/diodes-incorporated/DCX144EH-7/DCX144EH-7DICT-ND/5218295; Price: 0.42; Type: 1 NPN, 1 PNP - Pre-Biased (Dual); Device Package: SOT-563, SOT-666